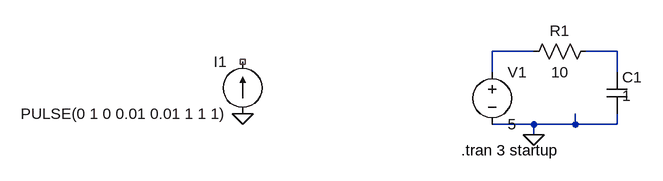
[diagram p0: schematic test_variable_cap.asc]
test_variable_cap.asc, the LTspice schematic file:
Version 4
SHEET 1 880 680
WIRE 144 144 80 144
WIRE 272 144 224 144
WIRE 80 176 80 144
WIRE 272 176 272 144
WIRE 144 256 80 256
WIRE 208 256 208 240
WIRE 208 256 144 256
WIRE 272 256 272 240
WIRE 272 256 208 256
WIRE 144 272 144 256
FLAG 144 272 0
FLAG -304 240 0
SYMBOL current -304 240 R180
WINDOW 0 24 80 Left 2
WINDOW 3 24 0 Left 2
WINDOW 123 0 0 Left 0
WINDOW 39 0 0 Left 0
SYMATTR InstName I1
SYMATTR Value PULSE(0 1 0 0.01 0.01 1 1 1)
SYMBOL cap 256 176 R0
WINDOW 3 24 36 Left 2
SYMATTR InstName C1
SYMATTR Value 1
SYMBOL res 240 128 R90
WINDOW 0 0 56 VBottom 2
WINDOW 3 32 56 VTop 2
SYMATTR InstName R1
SYMATTR Value 10
SYMBOL voltage 80 160 R0
WINDOW 123 0 0 Left 0
WINDOW 39 0 0 Left 0
SYMATTR InstName V1
SYMATTR Value 5
TEXT 32 296 Left 2 !.tran 3 startup

The netlist it stands for:
* test_variable_cap.asc
I1 0 NC_01 PULSE(0 1 0 0.01 0.01 1 1 1)
C1 N002 0 1
R1 N002 N001 10
V1 N001 0 5
.tran 3 startup
.backanno
.end